# EasyEDA Pro project pdb.eprj, schematic dist-12x4
Board Name: dist-12x4; Create Date: 2025-12-15; Page Name: P1; Project Name: pdb; Schematic Name: dist-12x4; Update Date: 2025-12-15; Company: EasyEDA.com; Page Size: A4; Version: V1.0
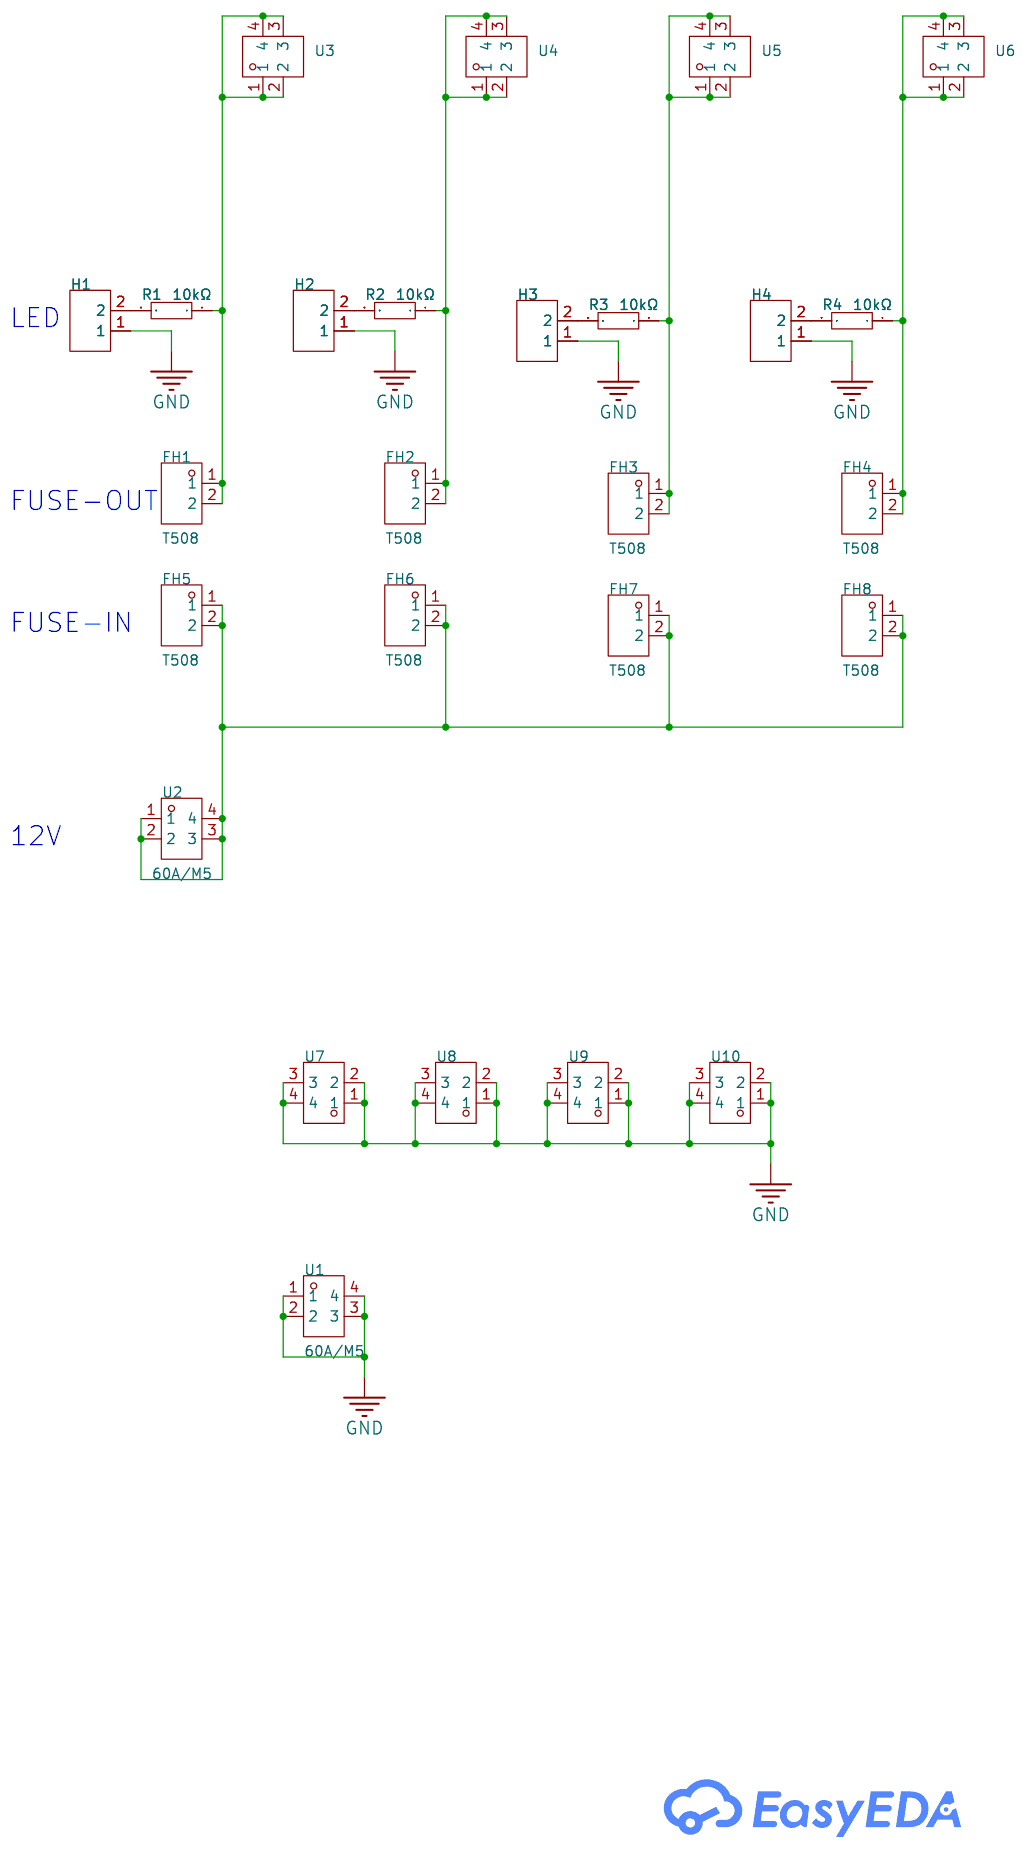
[diagram p1: schematic sheet]

## Parts
FH1  T508  [CONN-TH_T508]
FH2  T508  [CONN-TH_T508]
FH3  T508  [CONN-TH_T508]
FH4  T508  [CONN-TH_T508]
FH5  T508  [CONN-TH_T508]
FH6  T508  [CONN-TH_T508]
FH7  T508  [CONN-TH_T508]
FH8  T508  [CONN-TH_T508]
H1  PZ254V-11-02P  [HDR-TH_2P-P2.54-V-M]
H2  PZ254V-11-02P  [HDR-TH_2P-P2.54-V-M]
H3  PZ254V-11-02P  [HDR-TH_2P-P2.54-V-M]
H4  PZ254V-11-02P  [HDR-TH_2P-P2.54-V-M]
R1  10kΩ  [R1206]
R2  10kΩ  [R1206]
R3  10kΩ  [R1206]
R4  10kΩ  [R1206]
U1  60A/M5  [TH_4P-L11.1-W9.2-P5.00]
U2  60A/M5  [TH_4P-L11.1-W9.2-P5.00]
U3  T44001  [CONN-TH_T44001]
U4  T44001  [CONN-TH_T44001]
U5  T44001  [CONN-TH_T44001]
U6  T44001  [CONN-TH_T44001]
U7  T44001  [CONN-TH_T44001]
U8  T44001  [CONN-TH_T44001]
U9  T44001  [CONN-TH_T44001]
U10  T44001  [CONN-TH_T44001]

## Library data of the parts
FH1-FH8 = T508: LCSC Part Name: 三合一插片保险丝座; Supplier Part: C41355742; Manufacturer: XFCN(兴飞); Supplier Footprint: 插件; JLCPCB Part Class: Extended Part; Datasheet: https://atta.szlcsc.com/upload/public/pdf/source/20240815/411B016330D568D94D3F7EE5B5A5790B.pdf; Supplier: LCSC; Current Rating: 30A
H1-H4 = PZ254V-11-02P: Pin Structure:1x2P Pitch:2.54mm Row Spacing:- Circluar Pins/Square Pins:Pin Header Mounting Type:Through Hole Number of Rows:1 Number of Pins:2P Current Rating:- Voltage Rating (Max):- Length of Mating Pin:6mm Insulation Height:2.5mm Length of End Connect; LCSC Part Name: 1x2P 间距:2.54mm 方针 直插; Supplier Part: C492401; Manufacturer: XFCN(兴飞); Supplier Footprint: 插件,P=2.54mm; JLCPCB Part Class: Extended Part; Datasheet: https://item.szlcsc.com/datasheet/PZ254V-11-02P/502957.html; Supplier: LCSC; Pin Structure: 1x2P; Pitch: 2.54mm; Circluar Pins/Square Pins: Pin Header; Mounting Type: Through Hole; Number of Rows: 1; Number of Pins: 2P; Length of Mating Pin: 6mm; Insulation Height: 2.5mm; Length of End Connection Pin: 3mm; Contact Material: Brass; Operating Temperature: -40℃~+105℃; Color: Black
R1-R4 = 1206W4F1002T5E: Type:Thick Film Resistor Resistance:10kΩ Tolerance:±1% Tolerance:±1% Power(Watts):250mW Voltage-Supply(Max):200V Temperature Coefficient:±100ppm/℃ Temperature Coefficient:±100ppm/℃ Operating Temperature:-55℃~+155℃ Operating Temperature:-55℃~+155℃; LCSC Part Name: 10kΩ ±1% 250mW 厚膜电阻; Supplier Part: C17902; Manufacturer: UNI-ROYAL(厚声); Supplier Footprint: 1206; JLCPCB Part Class: Basic Part; Datasheet: https://item.szlcsc.com/datasheet/1206W4F1002T5E/18590.html; Supplier: LCSC; Type: Thick Film Resistor; Tolerance: ±1%; Power(Watts): 250mW; Voltage-Supply(Max): 200V; Temperature Coefficient: ±100ppm/℃; Operating Temperature: -55℃~+155℃
U1 U2 = TM54111092-1250: LCSC Part Name: PCB焊接端子 压铆螺母 M5  四脚 11.1x9.2x12.5mm; Supplier Part: C7496724; Manufacturer: XFCN(兴飞); Supplier Footprint: 插件; JLCPCB Part Class: Extended Part; Datasheet: https://item.szlcsc.com/datasheet/TM54111092-1250/8562990.html; Supplier: LCSC; Screw Hole Size: M5; Number of Leg: 4
U3-U10 = T44001: LCSC Part Name: 2件套 四脚 M4; Supplier Part: C481447; Manufacturer: XFCN(兴飞); Supplier Footprint: 插件; JLCPCB Part Class: Extended Part; Datasheet: https://item.szlcsc.com/datasheet/T44001/488882.html; Supplier: LCSC; appearance and shape: Bench-shaped; Screw Hole Size: M4; Number of Leg: 4; Connectable Bits: 1; Terminal Type: Top

## Nets
GND: H1.1 H2.1 H3.1 H4.1 U1.1 U1.2 U1.3 U1.4 U7.1 U7.2 U7.3 U7.4 U8.1 U8.2 U8.3 U8.4 U9.1 U9.2 U9.3 U9.4 U10.1 U10.2 U10.3 U10.4
$1N300: FH5.1 FH5.2 FH6.1 FH6.2 FH7.1 FH7.2 FH8.1 FH8.2 U2.1 U2.2 U2.3 U2.4
$1N955: FH1.1 FH1.2 R1.1 U3.1 U3.2 U3.3 U3.4
$1N1606: H1.2 R1.2
$1N9347: FH2.1 FH2.2 R2.1 U4.1 U4.2 U4.3 U4.4
$1N9352: H2.2 R2.2
$1N9551: FH3.1 FH3.2 R3.1 U5.1 U5.2 U5.3 U5.4
$1N9563: H3.2 R3.2
$1N9759: FH4.1 FH4.2 R4.1 U6.1 U6.2 U6.3 U6.4
$1N9771: H4.2 R4.2

## Notes on the sheet
- LED
- FUSE-OUT
- FUSE-IN
- 12V
